# Altium schematic sheet 0076_TBT_0_PA_CONNECTOR.SchDoc
size A3
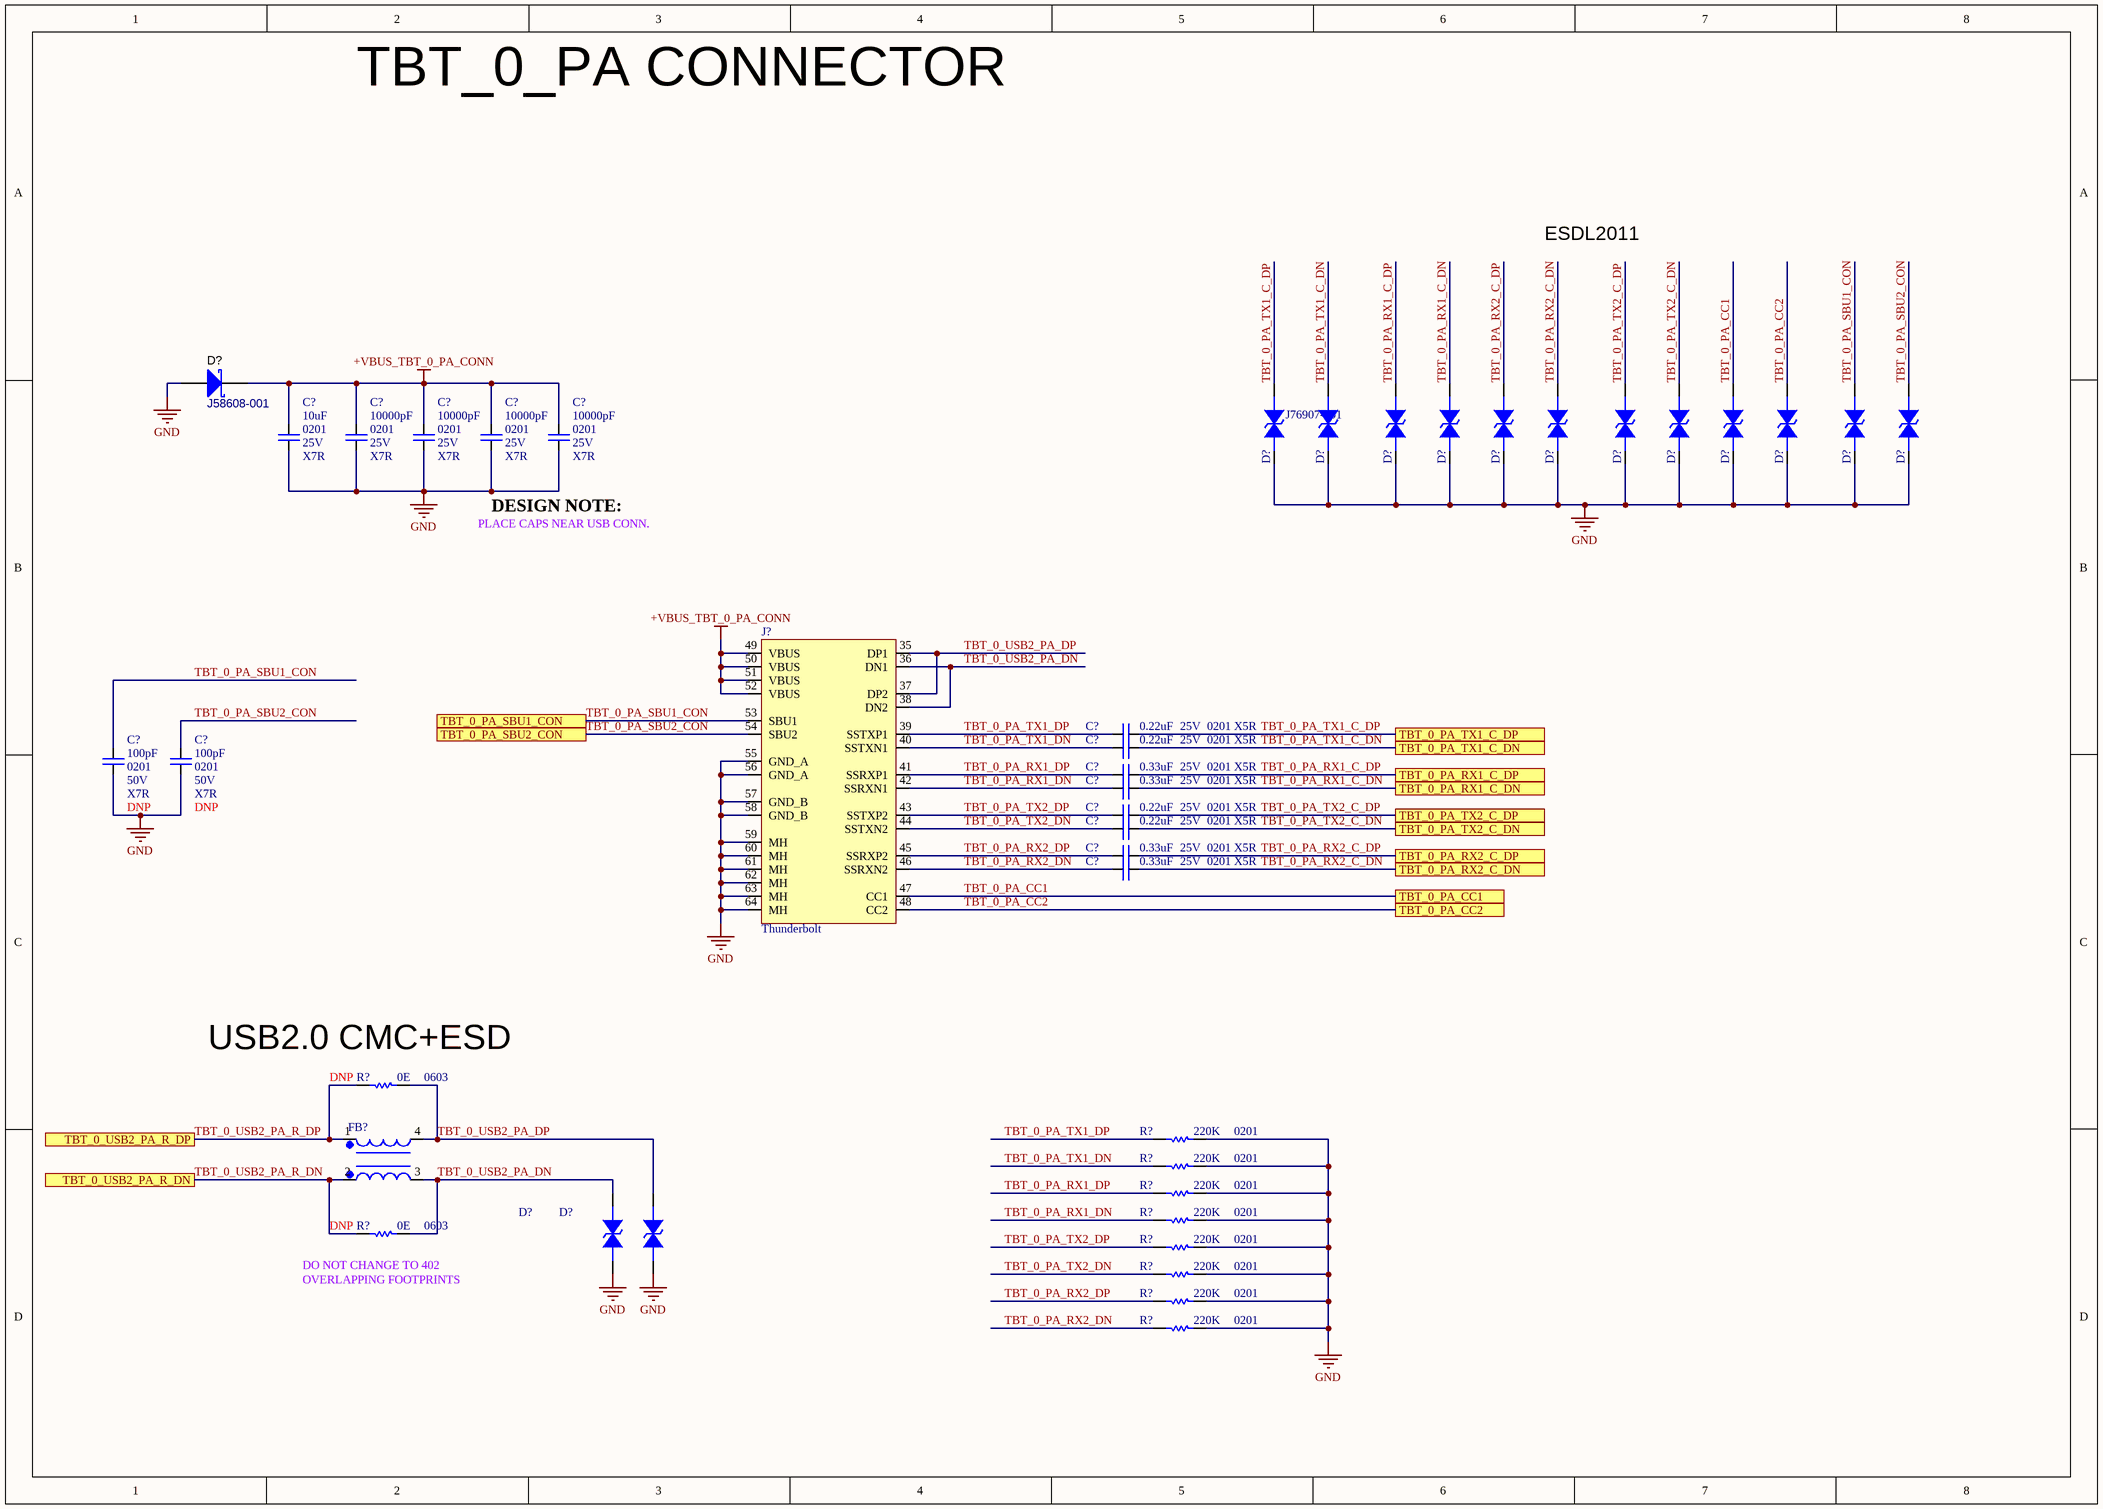
[diagram p0: 0076_TBT_0_PA_CONNECTOR.SchDoc]

## Parts
(Parts that share a designator on the sheet are numbered #1, #2 ... from top to bottom, then left to right.)
C?#1  value 10uF  Case/Package: 0201  Voltage: 25V  Dielectric: X7R  [CAPC0201]
C?#2  value 10000pF  Case/Package: 0201  Voltage: 25V  Dielectric: X7R  [CAPC0201]
C?#3  value 10000pF  Case/Package: 0201  Voltage: 25V  Dielectric: X7R  [CAPC0201]
C?#4  value 10000pF  Case/Package: 0201  Voltage: 25V  Dielectric: X7R  [CAPC0201]
C?#5  value 10000pF  Case/Package: 0201  Voltage: 25V  Dielectric: X7R  [CAPC0201]
C?#6  value 0.22uF  Case/Package: 0201  Voltage: 25V  Dielectric: X5R  [CAPC0201]
C?#7  value 0.22uF  Case/Package: 0201  Voltage: 25V  Dielectric: X5R  [CAPC0201]
C?#8  value 100pF  Case/Package: 0201  Voltage: 50V  Dielectric: X7R  [CAPC0201]
C?#9  value 100pF  Case/Package: 0201  Voltage: 50V  Dielectric: X7R  [CAPC0201]
C?#10  value 0.33uF  Case/Package: 0201  Voltage: 25V  Dielectric: X5R  [CAPC0201]
C?#11  value 0.33uF  Case/Package: 0201  Voltage: 25V  Dielectric: X5R  [CAPC0201]
C?#12  value 0.22uF  Case/Package: 0201  Voltage: 25V  Dielectric: X5R  [CAPC0201]
C?#13  value 0.22uF  Case/Package: 0201  Voltage: 25V  Dielectric: X5R  [CAPC0201]
C?#14  value 0.33uF  Case/Package: 0201  Voltage: 25V  Dielectric: X5R  [CAPC0201]
C?#15  value 0.33uF  Case/Package: 0201  Voltage: 25V  Dielectric: X5R  [CAPC0201]
D?#1  J58608-001
D?#2  Manufacturer Part Number: J76907-001  (hidden comment: ESD5341N)
D?#3  ESD5341N  (value not drawn)
D?#4  ESD5341N  (value not drawn)
D?#5  ESD5341N  (value not drawn)
D?#6  ESD5341N  (value not drawn)
D?#7  ESD5341N  (value not drawn)
D?#8  ESD5341N  (value not drawn)
D?#9  ESD5341N  (value not drawn)
D?#10  ESD5341N  [ESD0402]  (value not drawn)
D?#11  ESD5341N  [ESD0402]  (value not drawn)
D?#12  ESD5341N  [ESD0402]  (value not drawn)
D?#13  ESD5341N  [ESD0402]  (value not drawn)
D?#14  ESD5341N  [ESD0402]  (value not drawn)
D?#15  ESD5341N  [ESD0402]  (value not drawn)
FB?  WCM3216F2SF-900T04  [CHOKE]  (value not drawn)
J?  Thunderbolt
R?#1  value 0E  Case/Package: 0603  [RESC0603]  (hidden comment: Res)
R?#2  value 220K  Case/Package: 0201  [RESC0201]  (hidden comment: Res)
R?#3  value 220K  Case/Package: 0201  [RESC0201]  (hidden comment: Res)
R?#4  value 220K  Case/Package: 0201  [RESC0201]  (hidden comment: Res)
R?#5  value 220K  Case/Package: 0201  [RESC0201]  (hidden comment: Res)
R?#6  value 0E  Case/Package: 0603  [RESC0603]  (hidden comment: Res)
R?#7  value 220K  Case/Package: 0201  [RESC0201]  (hidden comment: Res)
R?#8  value 220K  Case/Package: 0201  [RESC0201]  (hidden comment: Res)
R?#9  value 220K  Case/Package: 0201  [RESC0201]  (hidden comment: Res)
R?#10  value 220K  Case/Package: 0201  [RESC0201]  (hidden comment: Res)

## Ports
TBT_0_PA_CC1, TBT_0_PA_CC2, TBT_0_PA_RX1_C_DN, TBT_0_PA_RX1_C_DP, TBT_0_PA_RX2_C_DN, TBT_0_PA_RX2_C_DP, TBT_0_PA_SBU1_CON, TBT_0_PA_SBU2_CON, TBT_0_PA_TX1_C_DN, TBT_0_PA_TX1_C_DP, TBT_0_PA_TX2_C_DN, TBT_0_PA_TX2_C_DP, TBT_0_USB2_PA_R_DN, TBT_0_USB2_PA_R_DP

## Nets
+VBUS_TBT_0_PA_CONN: C?#1.1 C?#2.1 C?#3.1 C?#4.1 C?#5.1 D?#1.K J?.49(VBUS) J?.50(VBUS) J?.51(VBUS) J?.52(VBUS)
GND: C?#1.2 C?#2.2 C?#3.2 C?#4.2 C?#5.2 C?#8.2 C?#9.2 D?#1.A D?#2.1 D?#3.1 D?#4.1 D?#5.1 D?#6.1 D?#7.1 D?#8.1 D?#9.1 D?#10.1 D?#11.1 D?#12.1 D?#13.1 D?#14.2 D?#15.2 J?.55(GND_A) J?.56(GND_A) J?.57(GND_B) J?.58(GND_B) J?.59(MH) J?.60(MH) J?.61(MH) J?.62(MH) J?.63(MH) J?.64(MH) R?#2.2 R?#3.2 R?#4.2 R?#5.2 R?#7.2 R?#8.2 R?#9.2 R?#10.2
TBT_0_PA_CC1: D?#10.2 J?.47(CC1) ; port TBT_0_PA_CC1
TBT_0_PA_CC2: D?#11.2 J?.48(CC2) ; port TBT_0_PA_CC2
TBT_0_PA_RX1_C_DN: C?#11.2 D?#5.2 ; port TBT_0_PA_RX1_C_DN
TBT_0_PA_RX1_C_DP: C?#10.2 D?#4.2 ; port TBT_0_PA_RX1_C_DP
TBT_0_PA_RX1_DN: C?#11.1 J?.42(SSRXN1) R?#5.1
TBT_0_PA_RX1_DP: C?#10.1 J?.41(SSRXP1) R?#4.1
TBT_0_PA_RX2_C_DN: C?#15.2 D?#7.2 ; port TBT_0_PA_RX2_C_DN
TBT_0_PA_RX2_C_DP: C?#14.2 D?#6.2 ; port TBT_0_PA_RX2_C_DP
TBT_0_PA_RX2_DN: C?#15.1 J?.46(SSRXN2) R?#10.1
TBT_0_PA_RX2_DP: C?#14.1 J?.45(SSRXP2) R?#9.1
TBT_0_PA_SBU1_CON: C?#8.1 D?#12.2 J?.53(SBU1) ; port TBT_0_PA_SBU1_CON
TBT_0_PA_SBU2_CON: C?#9.1 D?#13.2 J?.54(SBU2) ; port TBT_0_PA_SBU2_CON
TBT_0_PA_TX1_C_DN: C?#7.2 D?#3.2 ; port TBT_0_PA_TX1_C_DN
TBT_0_PA_TX1_C_DP: C?#6.2 D?#2.2 ; port TBT_0_PA_TX1_C_DP
TBT_0_PA_TX1_DN: C?#7.1 J?.40(SSTXN1) R?#3.1
TBT_0_PA_TX1_DP: C?#6.1 J?.39(SSTXP1) R?#2.1
TBT_0_PA_TX2_C_DN: C?#13.2 D?#9.2 ; port TBT_0_PA_TX2_C_DN
TBT_0_PA_TX2_C_DP: C?#12.2 D?#8.2 ; port TBT_0_PA_TX2_C_DP
TBT_0_PA_TX2_DN: C?#13.1 J?.44(SSTXN2) R?#8.1
TBT_0_PA_TX2_DP: C?#12.1 J?.43(SSTXP2) R?#7.1
TBT_0_USB2_PA_DN: D?#14.1 FB?.3 J?.36(DN1) J?.38(DN2) R?#6.2
TBT_0_USB2_PA_DP: D?#15.1 FB?.4 J?.35(DP1) J?.37(DP2) R?#1.2
TBT_0_USB2_PA_R_DN: FB?.2 R?#6.1 ; port TBT_0_USB2_PA_R_DN
TBT_0_USB2_PA_R_DP: FB?.1 R?#1.1 ; port TBT_0_USB2_PA_R_DP

## Notes on the sheet
- TBT_0_PA CONNECTOR
- ESDL2011
- DESIGN NOTE:
- PLACE CAPS NEAR USB CONN.
- (near R?#1) USB2.0 CMC+ESD
- (near R?#6) OVERLAPPING FOOTPRINTS
- (near R?#6) DO NOT CHANGE TO 402

## Library data of the parts
C?#1 = Cap: CAP CER 10uF 25V X5R 0201
C?#2-C?#5 = Cap: CAP CER 10000pF 25V X7R 0201
C?#6 C?#7 C?#12 C?#13 = Cap: CAP CER 0.22uF 25V X5R 0201
C?#8 C?#9 = Cap: CAP CER 100pF 50V X7R 0201; DNP: DNP
C?#10 C?#11 C?#14 C?#15 = Cap: CAP CER 0.33uF 25V X5R 0201
D?#1 = SCHOTTKY: Diode, Schottky, 40V, 5A, SMC; ComponentLink1Description: Datasheet link; ComponentLink1URL: http://www.comchip.com.tw/cms/UserFiles/QW-BB012%20CDBC520-G%7E5100-G%20RevC809622.pdf; Manufacturer Part Number: *; Case/Package: *
D?#2 D?#10-D?#13 = ESD5341N: 1-Line, Bi-directional, Transient Voltage Suppressors.1pF.; Case/Package: 0201
  D?#10-D?#13: Manufacturer Part Number: ESD5341N
D?#3-D?#9 D?#14 D?#15 = ESD5341N: 1-Line, Bi-directional, Transient Voltage Suppressors.1pF.; Manufacturer Part Number: J76907-001; Case/Package: 0201
FB? = WCM3216F2SF-900T04: Power, Signal Line 90 Ohms @ 100MHz 300 mOhm 50V SMD,3.2x1.6x2mm Common Mode Filters RoHS; Manufacturer Part Number: WCM3216F2SF-900T04; Case/Package: 3.2x1.6x2mm
R?#1 R?#6 = Res: Thick Film Resistor - 0ohm, 1%, 0603; DNP: DNP
R?#2-R?#5 R?#7-R?#10 = Res: Thick Film Resistor -  220Kohm, 1%, 0201